# Altium schematic sheet POWER.SchDoc: POWER
size A; SheetNumber: 8; SheetTotal: 8
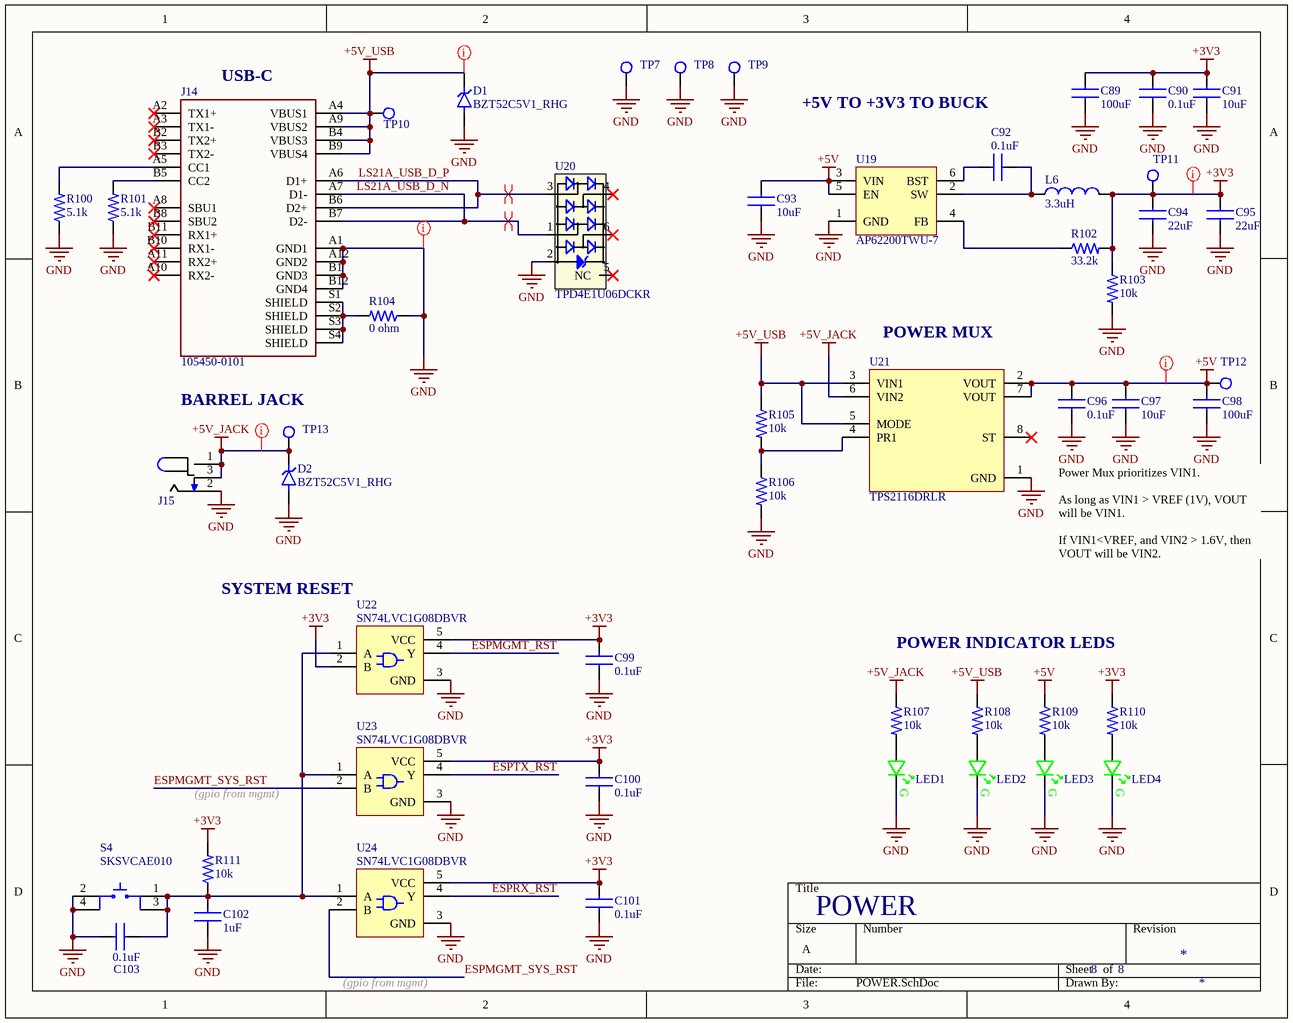
[diagram p0: POWER.SchDoc]

## Parts
C89  100uF  [CAP_0805]
C90  0.1uF  [CAP_0402]
C91  10uF  [CAP_0402]
C92  0.1uF  [CAP_0402]
C93  10uF  [CAP_0402]
C94  22uF  [CAP_0402]
C95  22uF  [CAP_0402]
C96  0.1uF  [CAP_0402]
C97  10uF  [CAP_0402]
C98  100uF  [CAP_0805]
C99  0.1uF  [CAP_0402]
C100  0.1uF  [CAP_0402]
C101  0.1uF  [CAP_0402]
C102  1uF  [CAP_0402]
C103  0.1uF  [CAP_0402]
D1  BZT52C5V1_RHG  [D_BZT52C5V1_RHG]
D2  BZT52C5V1_RHG  [D_BZT52C5V1_RHG]
J14  105450-0101  [CONN_105450-0101]
J15  Power Jack  [CONN_DC-005-20A]  (value not drawn)
L6  3.3uH  [L_IHLP2020CZER3R3M01]
LED1  LED_SM0402GC  [LED_FP-SM0402GC-MFG]  (value not drawn)
LED2  LED_SM0402GC  [LED_FP-SM0402GC-MFG]  (value not drawn)
LED3  LED_SM0402GC  [LED_FP-SM0402GC-MFG]  (value not drawn)
LED4  LED_SM0402GC  [LED_FP-SM0402GC-MFG]  (value not drawn)
R100  5.1k  [RES_0402]
R101  5.1k  [RES_0402]
R102  33.2k  [RES_0402]
R103  10k  [RES_0402]
R104  0 ohm  [RES_0402]
R105  10k  [RES_0402]
R106  10k  [RES_0402]
R107  10k  [RES_0402]
R108  10k  [RES_0402]
R109  10k  [RES_0402]
R110  10k  [RES_0402]
R111  10k  [RES_0402]
S4  SKSVCAE010  [SW_SKSVCAE010]
TP7  Test Point 1MM  [TP_PAD-1MM]  (value not drawn)  (no BOM)
TP8  Test Point 1MM  [TP_PAD-1MM]  (value not drawn)  (no BOM)
TP9  Test Point 1MM  [TP_PAD-1MM]  (value not drawn)  (no BOM)
TP10  Test Point 1MM  [TP_PAD-1MM]  (value not drawn)  (no BOM)
TP11  Test Point 1MM  [TP_PAD-1MM]  (value not drawn)  (no BOM)
TP12  Test Point 1MM  [TP_PAD-1MM]  (value not drawn)  (no BOM)
TP13  Test Point 1MM  [TP_PAD-1MM]  (value not drawn)  (no BOM)
U19  AP62200TWU-7  [IC_AP62200TWU-7]
U20  TPD4E1U06DCKR  [IC_TPD4E1U06DCKR]
U21  TPS2116DRLR  [IC_TPS2116]
U22  SN74LVC1G08DBVR  [IC_SN74LVC1G08DBVR]
U23  SN74LVC1G08DBVR  [IC_SN74LVC1G08DBVR]
U24  SN74LVC1G08DBVR  [IC_SN74LVC1G08DBVR]

## Nets
+3V3: C89.2 C90.2 C91.2 C94.2 C95.2 C99.2 C100.2 C101.2 L6.2 R102.2 R103.1 R110.1 R111.2 TP11.1 U22.2(B) U22.5(VCC) U23.5(VCC) U24.5(VCC)
+5V: C93.2 C96.2 C97.2 C98.2 R109.1 TP12.1 U19.3(VIN) U19.5(EN) U21.2(VOUT) U21.7(VOUT)
+5V_JACK: D2.C(K) J15.1 J15.3 R107.1 TP13.1 U21.6(VIN2)
+5V_USB: D1.C(K) J14.A4(VBUS1) J14.A9(VBUS2) J14.B4(VBUS3) J14.B9(VBUS4) R105.1 R108.1 TP10.1 U21.3(VIN1) U21.5(MODE)
GND: C89.1 C90.1 C91.1 C93.1 C94.1 C95.1 C96.1 C97.1 C98.1 C99.1 C100.1 C101.1 C102.1 C103.1 D1.A D2.A J14.A1(GND1) J14.A12(GND2) J14.B1(GND3) J14.B12(GND4) J15.2 LED1.2 LED2.2 LED3.2 LED4.2 R100.1 R101.1 R103.2 R104.1 R106.2 S4.2 S4.4 TP7.1 TP8.1 TP9.1 U19.1(GND) U20.2(GND) U21.1(GND) U22.3(GND) U23.3(GND) U24.3(GND)
ESPMGMT_RST: U22.4(Y)
ESPMGMT_SYS_RST: U23.2(B) U24.2(B)
ESPRX_RST: U24.4(Y)
ESPTX_RST: U23.4(Y)
LS21A_USB_D_N: J14.A7(D1-) J14.B7(D2-) U20.1(D+)
LS21A_USB_D_P: J14.A6(D1+) J14.B6(D2+) U20.3(D+)
NetC92_1: C92.1 L6.1 U19.2(SW)
NetC92_2: C92.2 U19.6(BST)
NetC102_2: C102.2 C103.2 R111.1 S4.1 S4.3 U22.1(A) U23.1(A) U24.1(A)
NetJ14_A5: J14.A5(CC1) R100.2
NetJ14_B5: J14.B5(CC2) R101.2
NetJ14_S1: J14.S1(SHIELD) J14.S2(SHIELD) J14.S3(SHIELD) J14.S4(SHIELD) R104.2
NetLED1_1: LED1.1 R107.2
NetLED2_1: LED2.1 R108.2
NetLED3_1: LED3.1 R109.2
NetLED4_1: LED4.1 R110.2
NetR102_1: R102.1 U19.4(FB)
NetR105_2: R105.2 R106.1 U21.4(PR1)

Not connected (* = marked no-connect by the designer): J14 A2(TX1+)* A3(TX1-)* A8(SBU1)* A10(RX2-)* A11(RX2+)* B2(TX2+)* B3(TX2-)* B8(SBU2)* B10(RX1-)* B11(RX1+)*; U20 4(D-)* 5(NC)* 6(D-)*; U21 8(ST)*

## Layout directives
differential pair: LS21A_USB_D_N, LS21A_USB_D_P
net class Power: +3V3, +5V, +5V_JACK, +5V_USB, GND

## Notes on the sheet
- (near J14) USB-C
- +5V TO +3V3 TO BUCK
- (near U21) POWER MUX
- BARREL JACK
- Power Mux prioritizes VIN1.
  As long as VIN1 > VREF (1V), VOUT will be VIN1.
  If VIN1<VREF, and VIN2 > 1.6V, then VOUT will be VIN2.
- (near U22) SYSTEM RESET
- POWER INDICATOR LEDS
- (gpio from mgmt)
- (in symbol LED_SM0402GC) G

## Library data of the parts
C89 C98 = CAP_GRM21BR60J107ME15L: 0805 100 uF 6.3 V ±20% Tolerance X5R Multilayer Ceramic Chip Capacitor; Manufacturer: Murata; Voltage Rating: 6.3V; Supplier 1: Digi-Key; Manufacturer Part Number: GRM21BR60J107ME15L; RoHS: Yes; Category: Ceramic Capacitors; Stock 1: 569112; Pricing 1: 1=1.15000, 10=0.90900, 50=0.78800, 100=0.68180, 500=0.51516, 1000=0.45456 (USD); Mounting Technology: Surface Mount; Case/Package: 0805; Case Code (Metric): 2012; Case Code (Imperial): 0805; Min Operating Temperature: -55°C; Max Operating Temperature: 85°C; Packaging: Cut Tape; Dielectric: X5R; Tolerance: 20%; Voltage Rating (DC): 6.3V; Value: 100uF; Series: GRM; Length: 0.079inch; Width: 0.049inch; Thickness: 0.057inch; Reach SVHC Compliant: Yes; Lead Free: Lead Free; RoHS Compliant: Yes; ComponentLink1URL: http://www.farnell.com/datasheets/1957830.pdf?src-supplier=Farnell; ComponentLink1Description: http://www.farnell.com/datasheets/1957830.pdf?src-supplier=Farnell; ComponentLink2URL: http://www.farnell.com/datasheets/1957830.pdf?src-supplier=Element14; ComponentLink2Description: http://www.farnell.com/datasheets/1957830.pdf?src-supplier=Element14; ComponentLink3URL: https://search.murata.co.jp/Ceramy/image/img/A01X/G101/ENG/GRM21BR60J107ME15-01.pdf?src-supplier=Digi-Key; ComponentLink3Description: https://search.murata.co.jp/Ceramy/image/img/A01X/G101/ENG/GRM21BR60J107ME15-01.pdf?src-supplier=Digi-Key; ComponentLink4URL: http://www.farnell.com/datasheets/1957830.pdf?src-supplier=Newark; ComponentLink4Description: http://www.farnell.com/datasheets/1957830.pdf?src-supplier=Newark; Supplier Part Number 1: 490-13981-1-ND
C90 C92 C96 C99-C101 C103 = CAP_GCM155R71C104KA55J: Cap Ceramic 0.1uF 16V X7R 10% SMD 0402 125C Paper T/R; Manufacturer: Murata; Capacitance: 100nF; Supplier 1: Digi-Key; Manufacturer Part Number: GCM155R71C104KA55J; RoHS: Yes; Category: Ceramic Capacitors; Stock 1: 10738061; Pricing 1: 1=0.10000, 10=0.03500, 50=0.01920, 100=0.01560, 500=0.01116, 1000=0.00877, 2500=0.00798, 5000=0.00734 (USD); Mount: Surface Mount; Case/Package: 0402; Case Code (Imperial): 0402; Case Code (Metric): 1005; Min Operating Temperature: -55°C; Max Operating Temperature: 125°C; Tolerance: 10%; Voltage Rating: 16V; Voltage Rating (DC): 16V; Packaging: Tape and Reel; Package Quantity: 1; Dielectric: X7R; Termination: SMD/SMT; Series: GCM; Construction: Flat; Length: 1mm; Width: 0.5mm; Height: 0.5mm; Thickness: 0.022inch; Depth: 0.5mm; Ratings: AEC-Q200; Radiation Hardening: No; Lead Free: Lead Free; ComponentLink1URL: https://datasheet.ciiva.com/11618/product-11618848.pdf?src-supplier=Avnet; ComponentLink1Description: https://datasheet.ciiva.com/11618/product-11618848.pdf?src-supplier=Avnet; ComponentLink2URL: https://datasheet.ciiva.com/16440/gcm155r71c104ka55j-16440393.pdf?src-supplier=Future+Electronics; ComponentLink2Description: https://datasheet.ciiva.com/16440/gcm155r71c104ka55j-16440393.pdf?src-supplier=Future+Electronics; ComponentLink3URL: https://datasheet.ciiva.com/29542/product-29542474.pdf?src-supplier=Digi-Key; ComponentLink3Description: https://datasheet.ciiva.com/29542/product-29542474.pdf?src-supplier=Digi-Key; ComponentLink4URL: https://datasheet.ciiva.com/29542/product-29542475.pdf?src-supplier=Digi-Key; ComponentLink4Description: https://datasheet.ciiva.com/29542/product-29542475.pdf?src-supplier=Digi-Key; Supplier Part Number 1: 490-7998-1-ND
C91 C93 C97 = CAP_CL05A106MQ5NUNC: Cap Ceramic 10uF 6.3V X5R 20% SMD 0402 85°C Paper T/R; Manufacturer: Samsung; Supplier 1: Digi-Key; Manufacturer Part Number: CL05A106MQ5NUNC; RoHS: Yes; Category: Ceramic Capacitors; Stock 1: 3345553; Pricing 1: 1=0.27000, 10=0.18400, 50=0.11020, 100=0.09300, 500=0.06362, 1000=0.05629, 2500=0.05384, 5000=0.04894 (USD); Mount: Surface Mount; Case/Package: 0402; Case Code (Metric): 1005; Case Code (Imperial): 0402; Min Operating Temperature: -55°C; Max Operating Temperature: 85°C; Tolerance: 20%; Capacitance: 10uF; Dielectric: X5R; Packaging: Tape and Reel; Package Quantity: 1; Voltage Rating: 6.3V; Series: CL; Construction: Flat; Length: 1mm; Width: 0.02inch; Height: 0.5mm; Thickness: 0.028inch; Depth: 0.5mm; Radiation Hardening: No; ComponentLink1URL: https://datasheet.ciiva.com/16437/cl05a106mq5nunc-16437356.pdf?src-supplier=Future+Electronics; ComponentLink1Description: https://datasheet.ciiva.com/16437/cl05a106mq5nunc-16437356.pdf?src-supplier=Future+Electronics; ComponentLink2URL: https://datasheet.ciiva.com/26877/getdatasheetpartid-355289-26877841.pdf?src-supplier=Verical; ComponentLink2Description: https://datasheet.ciiva.com/26877/getdatasheetpartid-355289-26877841.pdf?src-supplier=Verical; Supplier Part Number 1: 1276-1451-1-ND
C94 C95 = CAP_GRM158R61A226ME15D: General Up to 85C Reflow soldering; Manufacturer: Murata; Supplier 1: Digi-Key; Manufacturer Part Number: GRM158R61A226ME15D; RoHS: Yes; Category: Ceramic Capacitors; Stock 1: 10275; Pricing 1: 1=0.48000, 10=0.33200, 50=0.23260, 100=0.19940, 500=0.14954, 1000=0.12627, 2500=0.11962 (USD); Supplier Part Number 1: 490-GRM158R61A226ME15DCT-ND
C102 = CAP_CL05A105KA5NQNC: Cap Ceramic 1uF 25V X5R 10% SMD 0402 85°C Cardboard T/R; Manufacturer: Samsung; Supplier 1: Digi-Key; Manufacturer Part Number: CL05A105KA5NQNC; RoHS: Yes; Category: Ceramic Capacitors; Pricing 1: 1=0.21000, 10=0.14900, 50=0.08460, 100=0.07000, 500=0.04910, 1000=0.04065, 2500=0.03784, 5000=0.03462 (USD); Mount: Surface Mount; Case/Package: 0402; Case Code (Metric): 1005; Case Code (Imperial): 0402; Material: Ceramic; Min Operating Temperature: -55°C; Max Operating Temperature: 85°C; Tolerance: 10%; Capacitance: 1uF; Voltage Rating: 25V; Packaging: Tape and Reel; Package Quantity: 10000; Dielectric: X5R; Series: CL; Construction: Flat; Length: 1mm; Width: 0.02inch; Height: 0.5mm; Depth: 0.5mm; Thickness: 0.022inch; Radiation Hardening: No; Lead Free: Lead Free; RoHS Compliant: Yes; ComponentLink1URL: https://datasheet.ciiva.com/3777/cl05a105ka5nqnc-3777709.pdf?src-supplier=Arrow+Electronics; ComponentLink1Description: https://datasheet.ciiva.com/3777/cl05a105ka5nqnc-3777709.pdf?src-supplier=Arrow+Electronics; ComponentLink2URL: https://datasheet.ciiva.com/25720/cl05a105ka5nqnc-25720771.pdf?src-supplier=Digi-Key; ComponentLink2Description: https://datasheet.ciiva.com/25720/cl05a105ka5nqnc-25720771.pdf?src-supplier=Digi-Key; ComponentLink3URL: https://datasheet.ciiva.com/29198/459147-da-01-en-vs-kondensator-0402-29198339.pdf?src-supplier=Conrad; ComponentLink3Description: https://datasheet.ciiva.com/29198/459147-da-01-en-vs-kondensator-0402-29198339.pdf?src-supplier=Conrad; Supplier Part Number 1: 1276-1445-6-ND
D1 D2 = D_BZT52C5V1_RHG: Vz=5.1V 4.8V~5.4V Izt=5mA; Manufacturer: Diodes; Manufacturer Part Number: BZT52C5V1-7-F; MP: BZT52C5V1 RHG; MF: Taiwan Semiconductor; Zener Voltage: 5.1V; Max Power Dissipation: 500mW; Impedance: 60R; Voltage Tolerance: 6%; Test Current: 5mA; Max Reverse Leakage Current: 2uA; Forward Voltage: 900mV; Output Current: 50mA; Availability: In Stock; SnapEDA_Link: https://www.snapeda.com/parts/BZT52C5V1%20RHG/Taiwan+Semiconductor/view-part/?ref=snap; Value: *; Price: None; Package: SOD-123F Taiwan Semiconductor; Purchase-URL: https://pricing.snapeda.com/search/part/BZT52C5V1 RHG/?ref=eda; Check_prices: https://www.snapeda.com/parts/BZT52C5V1%20RHG/Taiwan+Semiconductor/view-part/?ref=eda; Supplier 1: LCSC; RoHS: Yes; Category: Zener Diodes; Stock 1: 13380; Pricing 1: 20=0.0177, 200=0.0158, 600=0.0154, 3000=0.0137 (USD); Mounting Technology: Surface Mount; Pins: 2; Weight: 0.000353oz; Min Operating Temperature: -65°C; Max Operating Temperature: 150°C; Packaging: Tape and Reel; Package Quantity: 3000; Tolerance: 6%; Power Dissipation: 500mW; Series: -; Zener Current: 5mA; Power Rating: 500mW; Max Reverse Current: 2uA; Termination: SMD/SMT; Voltage Rating (DC): 5.1V; Working Voltage: 5.1V; Length: 2.85mm; Width: 1.7mm; Height: 1.35mm; Radiation Hardening: No; RoHS Compliant: Yes; Lead Free: Lead Free; Reach SVHC Compliant: No; ComponentLink1URL: https://datasheet.ciiva.com/15142/getdatasheetpartid-75143-15142417.pdf?src-supplier=Verical; ComponentLink1Description: https://datasheet.ciiva.com/15142/getdatasheetpartid-75143-15142417.pdf?src-supplier=Verical; ComponentLink2URL: https://datasheet.ciiva.com/4734/ds18004-73542-4734246.pdf?src-supplier=Mouser; ComponentLink2Description: https://datasheet.ciiva.com/4734/ds18004-73542-4734246.pdf?src-supplier=Mouser; ComponentLink3URL: https://datasheet.ciiva.com/22713/1670962-22713975.pdf?src-supplier=Element14; ComponentLink3Description: https://datasheet.ciiva.com/22713/1670962-22713975.pdf?src-supplier=Element14; Supplier Part Number 1: C151588
J14 = CONN_105450-0101: USB-C (USB TYPE-C) USB 3.2 Gen 2 (USB 3.1 Gen 2, Superspeed + (USB 3.1)) Receptacle Connector 24 Position Surface Mount, Right Angle; Through Hole; MF: Molex; MP: 105450-0101; Availability: In Stock; Check_prices: https://www.snapeda.com/parts/105450-0101/Molex/view-part/?ref=eda; Price: None; SnapEDA_Link: https://www.snapeda.com/parts/105450-0101/Molex/view-part/?ref=snap; Purchase-URL: https://pricing.snapeda.com/search/part/105450-0101/?ref=eda; Package: None; Value: *
J15 = CONN_DC-005-20A: Power Barrel Connector Jack 2.10mm ID (0.083"), 5.50mm OD (0.217") Through Hole, Right Angle; Value: CONN PWR JACK 2X5.5MM SOLDER; Digikey Link: https://www.digikey.com/product-detail/en/PJ-102A/CP-102A-ND/275425/?itemSeq=304982367; Digikey Part: CP-102A-ND; LCSC Part#: C136744; Type: Extended
L6 = L_IHLP2020CZER3R3M01: Inductor Power Shielded Wirewound 3.3uH 20% 100KHz Powdered Iron 5A 54.7mOhm DCR 2020 T/R; Manufacturer: Vishay Dale; Core Material: Metal,Composite; Saturation Current: 8.5A; Self Resonant Frequency: 31MHz; DC Resistance (DCR): 54.7mR; Supplier 1: LCSC; Manufacturer Part Number: IHLP2020CZER3R3M01; RoHS: Yes; Category: Fixed Inductors; Stock 1: 3402; Pricing 1: 1=0.6237, 10=0.5537, 30=0.5426, 100=0.471 (USD); Mounting Technology: Surface Mount; Case/Package: 2020; Min Operating Temperature: -55°C; Max Operating Temperature: 125°C; Tolerance: 20%; Packaging: Tape and Reel; Shielding: Shielded; Value: 3.3uH; Test Frequency: 100kHz; Max DC Current: 8.5A; Termination: SMD/SMT; RMS Current (Irms): 5A; Inductance Tolerance: 20%; Series: IHLP-2020CZ-01; Max Current Rating: 5A; Length: 5.49mm; Width: 5.18mm; Height: 3mm; Depth: 5.43mm; Radiation Hardening: No; Military Standard: Not; Lead Free: Lead Free; RoHS Compliant: Yes; Reach SVHC Compliant: Unknown; ComponentLink1URL: https://datasheet.ciiva.com/1051/lp20cz01-1051660.pdf?src-supplier=Digi-Key; ComponentLink1Description: https://datasheet.ciiva.com/1051/lp20cz01-1051660.pdf?src-supplier=Digi-Key; ComponentLink2URL: https://datasheet.ciiva.com/1051/lp20cz01-1051661.pdf?src-supplier=Digi-Key; ComponentLink2Description: https://datasheet.ciiva.com/1051/lp20cz01-1051661.pdf?src-supplier=Digi-Key; ComponentLink3URL: https://datasheet.ciiva.com/1051/lp20cz01-1051662.pdf?src-supplier=Digi-Key; ComponentLink3Description: https://datasheet.ciiva.com/1051/lp20cz01-1051662.pdf?src-supplier=Digi-Key; ComponentLink4URL: https://datasheet.ciiva.com/8494/lp20cz01-8494984.pdf?src-supplier=Avnet; ComponentLink4Description: https://datasheet.ciiva.com/8494/lp20cz01-8494984.pdf?src-supplier=Avnet; ComponentLink5URL: https://datasheet.ciiva.com/16390/lp20cz01-16390407.pdf?src-supplier=Future+Electronics; ComponentLink5Description: https://datasheet.ciiva.com/16390/lp20cz01-16390407.pdf?src-supplier=Future+Electronics; Supplier Part Number 1: C553993
LED1-LED4 = LED_SM0402GC: LED Uni-Color Green 575nm 2-Pin Chip 0402(1006Metric) T/R; Manufacturer: Bivar; Lens Color: Colorless; Lens Style: Flat; Lens Transparency: Clear; Luminous Intensity: 28.5mcd; Forward Voltage: 1.9V; Test Current: 20mA; Viewing Angle: 130°; Dominant Wavelength: 572nm; Lens Size: 1mm; Supplier 1: Digi-Key; Manufacturer Part Number: SM0402GC; RoHS: Yes; Category: LEDs; Stock 1: 128369; Pricing 1: 1=0.62000, 10=0.40800, 100=0.27020, 1000=0.20860, 2000=0.18849 (USD); Mounting Technology: Surface Mount; Case/Package: 0402; Color: Green; Case Code (Imperial): 0402; Case Code (Metric): 1005; Packaging: Tape and Reel; Length: 1mm; Width: 0.5mm; Height: 0.71mm; RoHS Compliant: Yes; ComponentLink1URL: https://www.bivar.com/portals/0/products/SM0402GC.pdf?src-supplier=Digi-Key; ComponentLink1Description: https://www.bivar.com/portals/0/products/SM0402GC.pdf?src-supplier=Digi-Key; ComponentLink2URL: https://www.bivar.com/parts_content/Datasheets/SM0402GC.pdf?src-supplier=Digi-Key; ComponentLink2Description: https://www.bivar.com/parts_content/Datasheets/SM0402GC.pdf?src-supplier=Digi-Key; Supplier Part Number 1: 492-2205-1-ND
R100 R101 = RES_RMCF0402FT5K10: Res Thick Film 0402 5.1K Ohm 1% 0.063W ±100ppm/°C Molded SMD Paper T/R; Manufacturer: Stackpole Electronics; Resistance: 5.1kR; Power Rating: 62.5mW; Max Power Dissipation: 63mW; Supplier 1: Digi-Key; Manufacturer Part Number: RMCF0402FT5K10; RoHS: Yes; Category: Chip SMD Resistors; Stock 1: 428257; Pricing 1: 1=0.10000, 10=0.01500, 100=0.00610, 1000=0.00274, 2500=0.00238, 5000=0.00197 (USD); Mount: Surface Mount; Case/Package: 0402; Case Code (Metric): 1005; Case Code (Imperial): 0402; Contact Plating: Tin,Matte; Min Operating Temperature: -55°C; Max Operating Temperature: 155°C; Packaging: Tape and Reel; Tolerance: 1%; Resistor Type: Thick Film; Number of Terminations: 2; Temperature Coefficient: 100ppm/°C; Features: Automotive AEC-Q200; Series: RMCF; Length: 0.039inch; Width: 0.02inch; Height: 0.016inch; Radiation Hardening: No; RoHS Compliant: Yes; ComponentLink1URL: http://components.arrow.com/part/dataview/51396875S385758N1174?src-supplier=Arrow+Electronics; ComponentLink1Description: http://components.arrow.com/part/dataview/51396875S385758N1174?src-supplier=Arrow+Electronics; ComponentLink2URL: https://www.seielect.com/catalog/SEI-RMCF_RMCP.pdf?src-supplier=Avnet; ComponentLink2Description: https://www.seielect.com/catalog/SEI-RMCF_RMCP.pdf?src-supplier=Avnet; ComponentLink3URL: https://www.seielect.com/catalog/SEI-Packaging.pdf?src-supplier=Digi-Key; ComponentLink3Description: https://www.seielect.com/catalog/SEI-Packaging.pdf?src-supplier=Digi-Key; ComponentLink4URL: https://www.seielect.com/catalog/SEI-RMCF_RMCP.pdf?src-supplier=Avnet+Asia; ComponentLink4Description: https://www.seielect.com/catalog/SEI-RMCF_RMCP.pdf?src-supplier=Avnet+Asia; Supplier Part Number 1: RMCF0402FT5K10CT-ND
R102 = RES_RC0402FR-0733K2L: Res General Purpose Thick Film 0402 33.2K Ohm 1% 1/16W ±100ppm/°C Molded SMD Paper T/R; Manufacturer: Yageo; Value: 33.2kR; Power Rating: 62.5mW; Voltage Rating: 50V; Max Power Dissipation: 63mW; Supplier 1: Digi-Key; Manufacturer Part Number: RC0402FR-0733K2L; RoHS: Yes; Category: Chip SMD Resistors; Stock 1: 594228; Pricing 1: 1=0.1, 10=0.015, 100=0.0073, 1000=0.00417, 2500=0.00342, 5000=0.00297 (USD); Case/Package: 0402; Case Code (Imperial): 0402; Case Code (Metric): 1005; Min Operating Temperature: -55°C; Max Operating Temperature: 155°C; Packaging: Tape and Reel; Tolerance: 1%; Termination: SMD/SMT; Temperature Coefficient: 100ppm/°C; Working Voltage: 50V; Number of Terminations: 2; Features: Moisture Resistant; Series: RC; Construction: Rectangular; Technology: THICK FILM; Length: 1mm; Depth: 0.5mm; Military Standard: Not; Lead Free: Lead Free; RoHS Compliant: Yes; ComponentLink1URL: https://datasheet.ciiva.com/12668/pyu-rc0402-51-rohs-l-6-r-12668254.pdf?src-supplier=Mouser; ComponentLink1Description: https://datasheet.ciiva.com/12668/pyu-rc0402-51-rohs-l-6-r-12668254.pdf?src-supplier=Mouser; ComponentLink2URL: https://datasheet.ciiva.com/16740/pyu-rc0402-51-rohs-l-6-r-16740856.pdf?src-supplier=Future+Electronics; ComponentLink2Description: https://datasheet.ciiva.com/16740/pyu-rc0402-51-rohs-l-6-r-16740856.pdf?src-supplier=Future+Electronics; Supplier Part Number 1: 311-33.2KLRCT-ND
R103 R105-R111 = RES_AC0402FR-0710KL: RES SMD 10K OHM 1% 1/16W 0402; Manufacturer: Yageo; Resistance: 10kR; Power Rating: 62.5mW; Voltage Rating: 50V; Temperature Coefficient: 100ppm/°C; Max Power Dissipation: 63mW; Supplier 1: Digi-Key; Manufacturer Part Number: AC0402FR-0710KL; RoHS: Yes; Category: Chip SMD Resistors; Stock 1: 2860; Pricing 1: 1=0.10000, 10=0.02200, 100=0.00900, 1000=0.00402, 2500=0.00349, 5000=0.00288 (USD); Case/Package: 0402; Case Code (Imperial): 0402; Case Code (Metric): 1005; Size Code: 0402; Min Operating Temperature: -55°C; Max Operating Temperature: 155°C; Tolerance: 1%; Packaging: Tape and Reel; Resistor Type: Thick Film; Termination: SMD/SMT; Number of Terminations: 2; Features: Moisture Resistant,Automotive AEC-Q200; Series: AC; Construction: Rectangular; Length: 0.039inch; Width: 0.02inch; Height: 0.015inch; Depth: 0.5mm; Military Standard: Not; Lead Free: Lead Free; RoHS Compliant: Yes; ComponentLink1URL: https://datasheet.ciiva.com/12656/pyu-ac-51-rohs-l-2-12656634.pdf?src-supplier=Mouser; ComponentLink1Description: https://datasheet.ciiva.com/12656/pyu-ac-51-rohs-l-2-12656634.pdf?src-supplier=Mouser; Supplier Part Number 1: YAG3436CT-ND
R104 = RES_RC0402JR-070RL: RES SMD 0 OHM JUMPER 1/16W 0402; Manufacturer: Yageo; Value: 0mR; Power Rating: 62.5mW; Tolerance: 5%; Voltage Rating: 50V; Max Power Dissipation: 63mW; Temperature Coefficient: 200ppm/°C; Supplier 1: Digi-Key; Manufacturer Part Number: RC0402JR-070RL; RoHS: Yes; Category: Chip SMD Resistors; Stock 1: 33185339; Pricing 1: 1=0.10000, 10=0.01200, 25=0.00840, 50=0.00640, 100=0.00480, 250=0.00364, 500=0.00290, 1000=0.00214, 5000=0.00154 (USD); Case/Package: 0402; Case Code (Metric): 1005; Case Code (Imperial): 0402; Contact Plating: Tin,Matte; Min Operating Temperature: -55°C; Max Operating Temperature: 155°C; Package Quantity: 1; Packaging: Tape and Reel; Resistor Type: Thick Film; Number of Terminations: 2; Termination: SMD/SMT; Features: Moisture Resistant; Series: RC; Technology: THICK FILM; Resistance Tolerance: 5%; Construction: Rectangular; Length: 1mm; Width: 0.02inch; Height: 0.016inch; Depth: 0.5mm; Radiation Hardening: No; Military Standard: Not; Lead Free: Lead Free; RoHS Compliant: Yes; ComponentLink1URL: https://datasheet.ciiva.com/2452/pyu-rc0402-51-rohs-l-6-2452608.pdf?src-supplier=Digi-Key; ComponentLink1Description: https://datasheet.ciiva.com/2452/pyu-rc0402-51-rohs-l-6-2452608.pdf?src-supplier=Digi-Key; ComponentLink2URL: https://datasheet.ciiva.com/7983/1018594-7983535.pdf?src-supplier=Element14; ComponentLink2Description: https://datasheet.ciiva.com/7983/1018594-7983535.pdf?src-supplier=Element14; ComponentLink3URL: https://datasheet.ciiva.com/22747/1018594-22747515.pdf?src-supplier=Element14; ComponentLink3Description: https://datasheet.ciiva.com/22747/1018594-22747515.pdf?src-supplier=Element14; ComponentLink4URL: https://datasheet.ciiva.com/2452/pyu-r-int-thick-7-2452609.pdf?src-supplier=Digi-Key; ComponentLink4Description: https://datasheet.ciiva.com/2452/pyu-r-int-thick-7-2452609.pdf?src-supplier=Digi-Key; ComponentLink5URL: https://datasheet.ciiva.com/2452/pyu-r-int-thick-7-2452610.pdf?src-supplier=Digi-Key; ComponentLink5Description: https://datasheet.ciiva.com/2452/pyu-r-int-thick-7-2452610.pdf?src-supplier=Digi-Key; ComponentLink6URL: https://datasheet.ciiva.com/8896/pyu-rc0402-51-rohs-l-6-8896201.pdf?src-supplier=Avnet; ComponentLink6Description: https://datasheet.ciiva.com/8896/pyu-rc0402-51-rohs-l-6-8896201.pdf?src-supplier=Avnet; ComponentLink7URL: https://datasheet.ciiva.com/15189/getdatasheetpartid-326379-15189533.pdf?src-supplier=Verical; ComponentLink7Description: https://datasheet.ciiva.com/15189/getdatasheetpartid-326379-15189533.pdf?src-supplier=Verical; Supplier Part Number 1: 311-0.0JRCT-ND
S4 = SW_SKSVCAE010: 2.8x1.9mm Compact Type with Projection Surface Mount SKSV Series Tact Switch; Manufacturer: Alps Electric; Supplier 1: Mouser; Manufacturer Part Number: SKSVCAE010; RoHS: Yes; Category: Tactile Switches; Stock 1: 17441; Pricing 1: 1=0.54000, 10=0.54000, 50=0.43600, 100=0.42100, 1000=0.37500, 10000=0.36200 (USD); RoHS Compliant: Yes; ComponentLink1URL: http://www.mouser.com/ds/2/15/ALPS_SKSVCAE010-463040.pdf?src-supplier=Mouser; ComponentLink1Description: http://www.mouser.com/ds/2/15/ALPS_SKSVCAE010-463040.pdf?src-supplier=Mouser; Supplier Part Number 1: 688-SKSVCAE010
TP7-TP13 = TP_PAD-1MM
U19 = IC_AP62200TWU-7: 4.2V to 18V Input, 2A Low Iq Synchronous Buck Converter, Pfm/pwm; Manufacturer: Diodes; Supplier 1: LCSC; Manufacturer Part Number: AP62200TWU-7; RoHS: Yes; Category: Voltage Regulators - Switching; Stock 1: 68810; Pricing 1: 5=0.127, 50=0.1034, 150=0.0916, 500=0.0743, 3000=0.0673, 6000=0.0637 (USD); Supplier Part Number 1: C2895288
U20 = IC_TPD4E1U06DCKR: TVS DIODE 5.5VWM 15VC SC70-6; Manufacturer: Texas Instruments; Direction: Unidirectional; Value: 1pF; Operating Supply Voltage: 5.5V; Min Breakdown Voltage: 6.5V; Clamping Voltage: 11V; Peak Pulse Power: 45W; Power Line Protection: Yes; Number of Channels: 4; Test Current: 1mA; Max Reverse Leakage Current: 10nA; Peak Pulse Current: 3A; Interface: LVDS,USB,Ethernet; Supplier 1: LCSC; Manufacturer Part Number: TPD4E1U06DCKR; RoHS: Yes; Category: Integrated Circuits (ICs); Stock 1: 448671; Pricing 1: 1=0.1276, 10=0.0987, 30=0.0864, 100=0.0709, 500=0.064, 1000=0.0478 (USD); Mounting Technology: Surface Mount; Case/Package: SC; Pins: 6; Min Operating Temperature: -40°C; Max Operating Temperature: 125°C; Package Quantity: 3000; Packaging: Tape and Reel; Reverse Standoff Voltage: 5.5V; Breakdown Voltage: 6.5V; Termination: SMD/SMT; ESD Protection: Yes; Working Voltage: 5.5V; Max Power Dissipation: 45W; Series: -; Number of Unidirectional Channels: 4; Length: 2.15mm; Width: 1.4mm; Height: 1mm; Reach SVHC Compliant: No; Lead Free: Lead Free; RoHS Compliant: Yes; ComponentLink1URL: https://datasheet.ciiva.com/12545/tpd4e1u06-224689-12545136.pdf?src-supplier=Mouser; ComponentLink1Description: https://datasheet.ciiva.com/12545/tpd4e1u06-224689-12545136.pdf?src-supplier=Mouser; ComponentLink2URL: https://datasheet.ciiva.com/6574/tpd4e1u06-6574672.pdf?src-supplier=Digi-Key; ComponentLink2Description: https://datasheet.ciiva.com/6574/tpd4e1u06-6574672.pdf?src-supplier=Digi-Key; Supplier Part Number 1: C194628
U21 = IC_TPS2116DRLR: 1.6-V to 5.5-V, 40-mΩ, 2.5-A, low-IQ, priority power multiplexer 8-SOT-5X3 -40 to 125; MF: Texas Instruments; Check_prices: https://www.snapeda.com/parts/TPS2116DRLR/Texas%20Instruments/view-part/5674360/?ref=eda; MP: TPS2116DRLR; Package: Package; Price: None; Availability: No availability data; SnapEDA_Link: https://www.snapeda.com/parts/TPS2116DRLR/Texas%20Instruments/view-part/5674360/?ref=snap; Value: *; Supplier 1: LCSC; Manufacturer: Texas Instruments; Manufacturer Part Number: TPS2116DRLR; RoHS: Yes; Category: Voltage Supervisors; Stock 1: 562; Pricing 1: 1=0.6651, 10=0.5457, 30=0.4853, 100=0.4264, 500=0.3914, 1000=0.3723 (USD); Supplier Part Number 1: C3235557
U22-U24 = IC_SN74LVC1G08DBVR: AND Gate IC 1 Channel  SOT-23-5; MF: Texas Instruments; Min Supply Voltage: 1.65V; Max Supply Voltage: 5.5V; Output Current: 32mA; Number of Inputs: 2; Propagation Delay: 4ns; Number of Outputs: 1; Quiescent Current: 10uA; High Level Output Current: -32mA; Turn-On Delay Time: 4.5ns; Package: SOT-23-5 Texas Instruments; Availability: Unavailable; Texas_Instruments-Purchase-URL: https://snapeda.com/shop?store=Texas+Instruments&id=78735; MP: SN74LVC1G08DBVR; SnapEDA_Link: https://www.snapeda.com/parts/SN74LVC1G08DBVR/Texas%20Instruments/view-part/78735/?ref=snap; Value: *; Price: None; Supplier 1: LCSC; Manufacturer: Texas Instruments; Manufacturer Part Number: SN74LVC1G08DBVR; RoHS: Yes; Category: Logic Gates; Stock 1: 24375; Pricing 1: 5=0.0774, 50=0.0637, 150=0.0568, 500=0.0517, 3000=0.0419, 6000=0.0399 (USD); Mounting Technology: Surface Mount; Case/Package: SOT-23; Pins: 5; Weight: 0.000557oz; Min Operating Temperature: -40°C; Max Operating Temperature: 125°C; Packaging: Tape and Reel; Logic Function: AND GATE; Number of Circuits: 1; Low Level Output Current: 32mA; Number of Gates: 1; Number of Input Lines: 2; Number of Output Lines: 1; Number of Elements: 1; Number of Bits: 1; Series: 74LVC; Technology: CMOS; Package Quantity: 1; Max Output current: 32mA; Termination: SMD/SMT; Radiation Hardening: No; Reach SVHC Compliant: No; Lead Free: Lead Free; RoHS Compliant: Yes; ComponentLink1URL: https://datasheet.ciiva.com/28540/1772545-28540795.pdf?src-supplier=Element14; ComponentLink1Description: https://datasheet.ciiva.com/28540/1772545-28540795.pdf?src-supplier=Element14; ComponentLink2URL: https://datasheet.ciiva.com/46439/1834190-46439158.pdf?src-supplier=Element14; ComponentLink2Description: https://datasheet.ciiva.com/46439/1834190-46439158.pdf?src-supplier=Element14; ComponentLink3URL: https://datasheet.ciiva.com/48703/001074511-da-01-en-ic-2-input-sn74lvc1g08dbvr-sot-23-5-tid-48703802.pdf?src-supplier=Conrad; ComponentLink3Description: https://datasheet.ciiva.com/48703/001074511-da-01-en-ic-2-input-sn74lvc1g08dbvr-sot-23-5-tid-48703802.pdf?src-supplier=Conrad; Supplier Part Number 1: C7666